# EAGLE schematic IRQF401RCT6 (EAGLE 7.6.0)
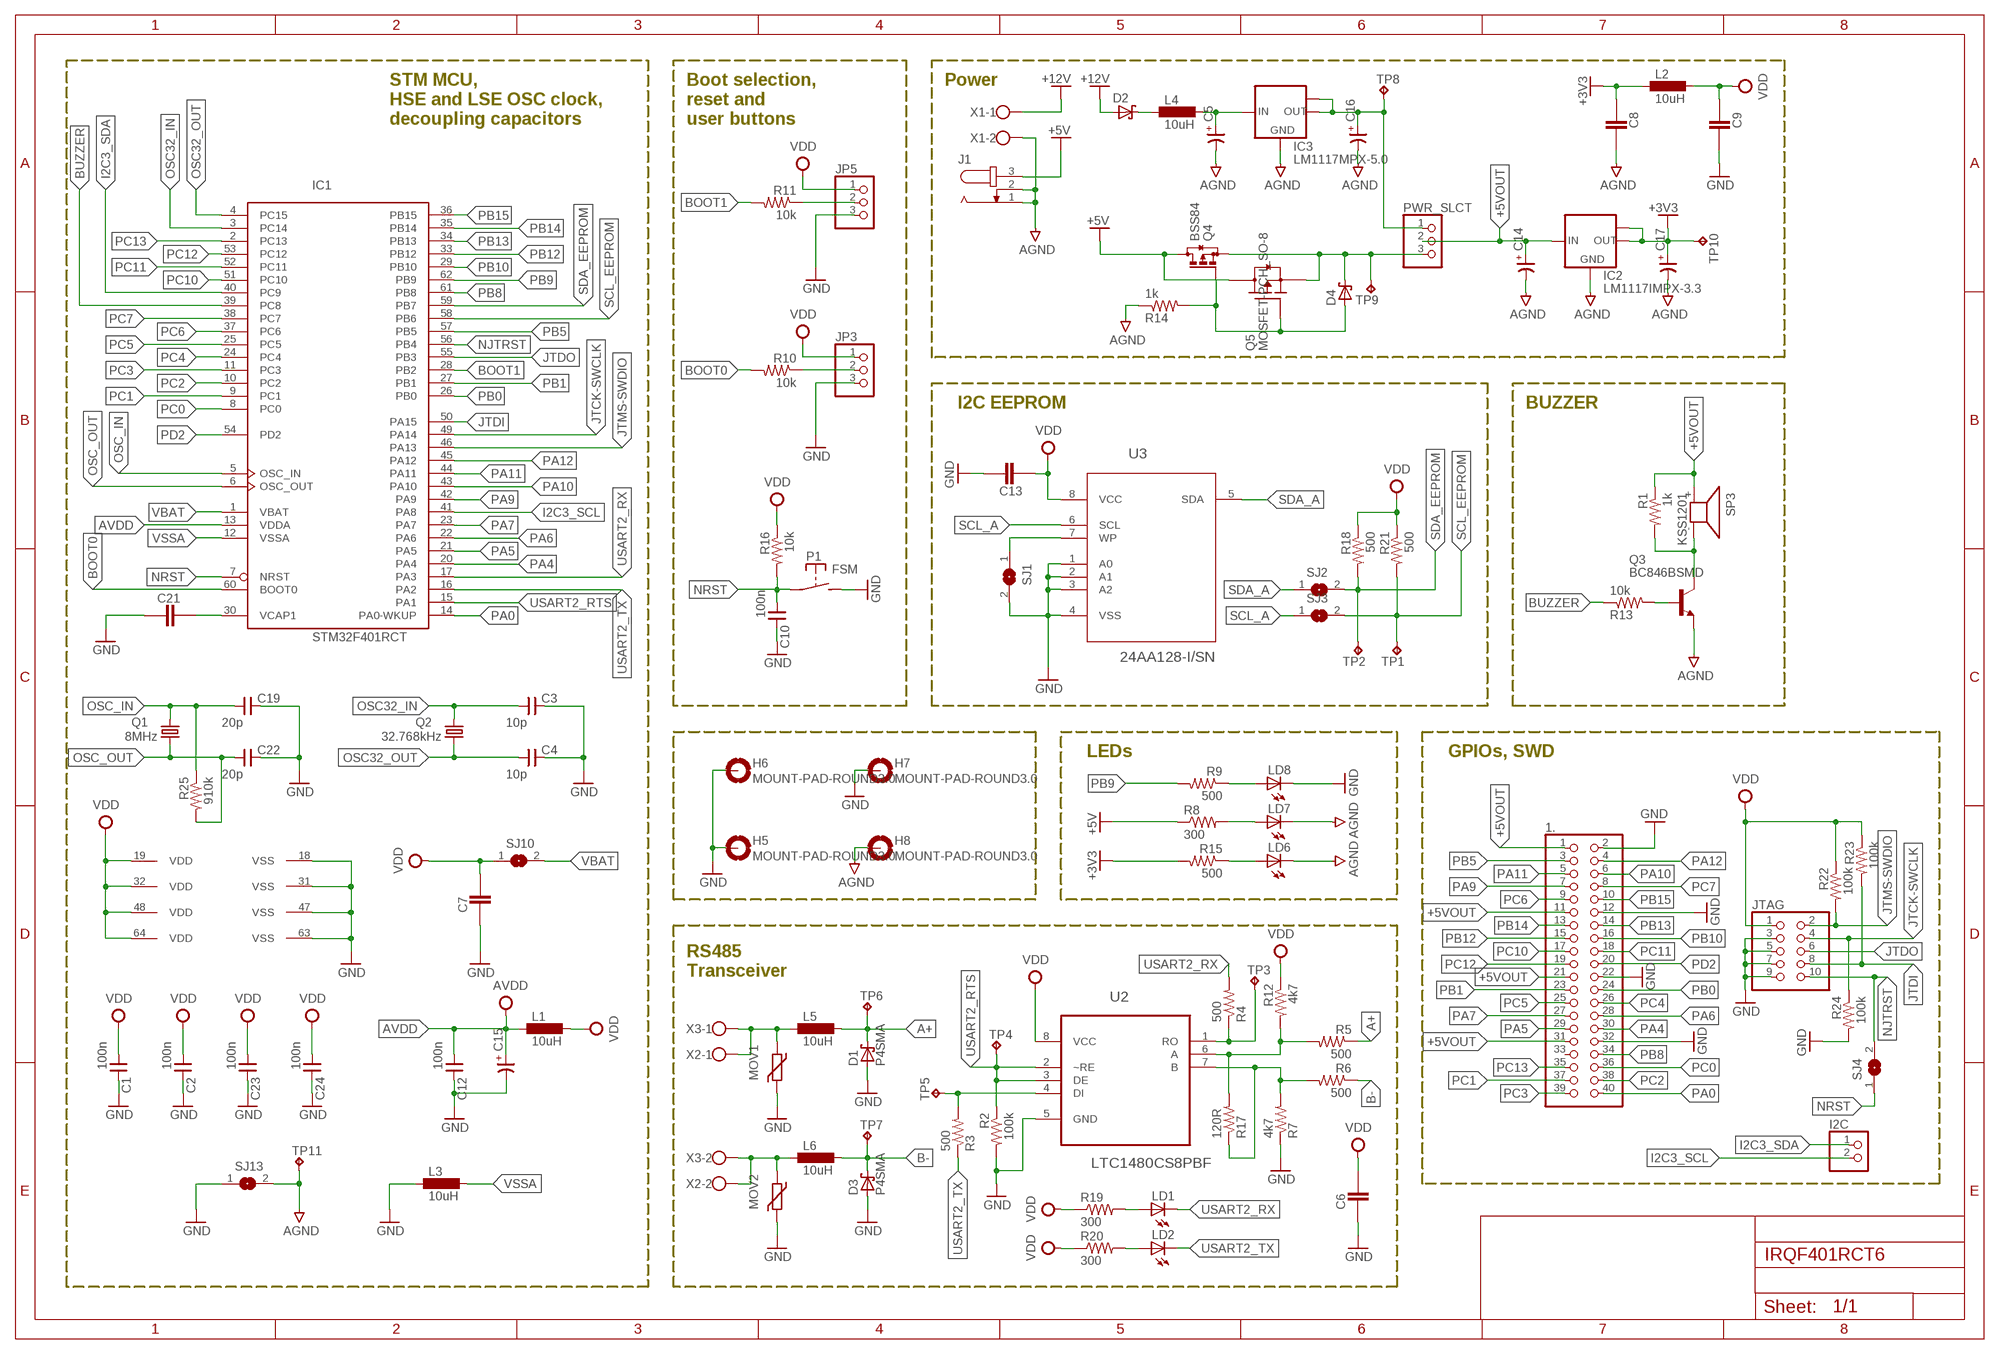
[diagram p0: schematic, sheet 1]

## Parts
1.  PINHD-2X20  [2X20]
C1  100n  CNP-0805  [0805]
C2  100n  CNP-0805  [0805]
C3  10p  CNP-0805  [0805]
C4  10p  CNP-0805  [0805]
C5  CP-3258-TE-B  [3528-TE-B]
C6  CAPACITOR_1206  [CAPC3215X168N]
C7  CAPACITOR_1206  [CAPC3215X168N]
C8  CAPACITOR_1206  [CAPC3215X168N]
C9  CAPACITOR_1206  [CAPC3215X168N]
C10  100n  CNP-0805  [0805]
C12  100n  CNP-0805  [0805]
C13  CAPACITOR_1206  [CAPC3215X168N]
C14  CP-3258-TE-B  [3528-TE-B]
C15  CP-3216  [3216/T]
C16  CP-3216-TE-A  [3216-TE-A]
C17  CP-3216-TE-A  [3216-TE-A]
C19  20p  CNP-0805  [0805]
C21  CAPACITOR_1206  [CAPC3215X168N]
C22  20p  CNP-0805  [0805]
C23  100n  CNP-0805  [0805]
C24  100n  CNP-0805  [0805]
D1  P4SMA  SCHOTTKY-DIODESMD  [SMB]
D2  SCHOTTKY_SMA  [DIOM5326X292N]
D3  P4SMA  SCHOTTKY-DIODESMD  [SMB]
D4  SCHOTTKY_SMA  [DIOM5326X292N]
H5  MOUNT-PAD-ROUND3.0  [3,0-PAD]
H6  MOUNT-PAD-ROUND3.0  [3,0-PAD]
H7  MOUNT-PAD-ROUND3.0  [3,0-PAD]
H8  MOUNT-PAD-ROUND3.0  [3,0-PAD]
I2C  PINHD-1X2  [1X02]
IC1  STM32F401RCT  [LQFP64]
IC2  LM1117IMPX-3.3  [SOT223]
IC3  LM1117MPX-5.0  [SOT223]
J1  JACK-PLUG1  [SPC4078]
JP3  PINHD-1X3  [1X03]
JP5  PINHD-1X3  [1X03]
JTAG  PINHD-2X5  [2X05]
L1  10uH  INDUCTOR_0603  [INDC1608X95N]
L2  10uH  INDUCTOR_0603  [INDC1608X95N]
L3  10uH  INDUCTOR_0603  [INDC1608X95N]
L4  10uH  INDUCTOR_0603  [INDC1608X95N]
L5  10uH  INDUCTOR_0603  [INDC1608X95N]
L6  10uH  INDUCTOR_0603  [INDC1608X95N]
LD1  LEDCHIPLED_0805  [CHIPLED_0805]
LD2  LEDCHIPLED_0805  [CHIPLED_0805]
LD6  LEDCHIPLED_0805  [CHIPLED_0805]
LD7  LEDCHIPLED_0805  [CHIPLED_0805]
LD8  LEDCHIPLED_0805  [CHIPLED_0805]
MOV1  VARISTOR_0805  [VARC2012X70N]
MOV2  VARISTOR_0805  [VARC2012X70N]
P1  FSM  [FSM]
PWR_SLCT  PINHD-1X3  [1X03]
Q1  8MHz  CRYTALHC49S  [HC49/S]
Q2  32.768kHz  CRYTALTC26H  [TC26H]
Q3  BC846BSMD  [SOT23]
Q4  BSS84  [SOT23]
Q5  MOSFET-PCH_SO-8  [SOIC127P600X175-8AN]
R1  1k  R-US_M0805  [M0805]
R2  100k  R-US_M0805  [M0805]
R3  500  R-US_M0805  [M0805]
R4  500  R-US_M0805  [M0805]
R5  500  R-US_M0805  [M0805]
R6  500  R-US_M0805  [M0805]
R7  4k7  R-US_M0805  [M0805]
R8  300  R-US_M0805  [M0805]
R9  500  R-US_M0805  [M0805]
R10  10k  R-US_M0805  [M0805]
R11  10k  R-US_M0805  [M0805]
R12  4k7  R-US_M0805  [M0805]
R13  10k  R-US_M0805  [M0805]
R14  1k  R-US_M0805  [M0805]
R15  500  R-US_M0805  [M0805]
R16  10k  R-US_M0805  [M0805]
R17  120R  R-US_M0805  [M0805]
R18  500  R-US_M0805  [M0805]
R19  300  R-US_M0805  [M0805]
R20  300  R-US_M0805  [M0805]
R21  500  R-US_M0805  [M0805]
R22  100k  R-US_M0805  [M0805]
R23  100k  R-US_M0805  [M0805]
R24  100k  R-US_M0805  [M0805]
R25  910k  R-US_M0805  [M0805]
SJ1  SJ  [SJ]
SJ2  SJ  [SJ]
SJ3  SJ  [SJ]
SJ4  SJ  [SJ]
SJ10  SJ  [SJ]
SJ13  SJ  [SJ]
SP3  KSS1201  [KSS1201]
TP1  TPTP10R  [TP10R]
TP2  TPTP10R  [TP10R]
TP3  TPTP10R  [TP10R]
TP4  TPTP10R  [TP10R]
TP5  TPTP10R  [TP10R]
TP6  TPTP10R  [TP10R]
TP7  TPTP10R  [TP10R]
TP8  TPTP10R  [TP10R]
TP9  TPTP10R  [TP10R]
TP10  TPTP10R  [TP10R]
TP11  TPTP10R  [TP10R]
U2  LTC1480CS8PBF  [SOIC127P600X175-8N]
U3  24AA128-I/SN  [SOIC127P600X175-8N]
X1  W237-102  [W237-102]
X2  W237-102  [W237-102]
X3  W237-102  [W237-102]

## Nets
+3V3: C8.1 C17.+ IC2.2(OUT) IC2.TAB(OUT1) L2.1 R15.2 TP10.TP
+5V: J1.3 Q4.3(D) Q5.5(D) R8.1
+5VOUT: 1..1 1..11 1..21 1..31 C14.+ IC2.3(IN) PWR_SLCT.2 R1.1 SP3.+
+12V: D2.A X1.1
A+: D1.C L5.2 R5.1 TP6.TP
AGND: C5.- C8.2 C14.- C16.- C17.- H8.B3,0(MOUNT) IC2.1(GND) IC3.1(GND) J1.1 J1.2 LD6.C LD7.C Q3.2(E) R14.1 SJ13.2 TP11.TP X1.2
AVDD: C12.1 C15.+ IC1.13(VDDA) L1.1
B-: D3.C L6.2 R6.1 TP7.TP
BOOT0: IC1.60(BOOT0) R10.2
BOOT1: IC1.28(PB2) R11.2
BUZZER: IC1.39(PC8) R13.1
GND: 1..2 1..12 1..22 1..32 C1.2 C2.2 C3.2 C4.2 C6.1 C7.1 C9.2 C10.2 C12.2 C13.2 C15.- C19.2 C21.1 C22.2 C23.2 C24.2 D1.A D3.A H5.B3,0(MOUNT) H6.B3,0(MOUNT) H7.B3,0(MOUNT) IC1.18(VSS) IC1.31(VSS) IC1.47(VSS) IC1.63(VSS) JP3.3 JP5.3 JTAG.3 JTAG.5 JTAG.7 JTAG.9 L3.1 LD8.C MOV1.1 MOV2.1 P1.P$2(S) R2.2 R7.1 R24.2 SJ1.2 SJ13.1 U2.5(GND) U3.1(A0) U3.2(A1) U3.3(A2) U3.4(VSS)
I2C3_SCL: I2C.2 IC1.41(PA8)
I2C3_SDA: I2C.1 IC1.40(PC9)
JTCK-SWCLK: IC1.49(PA14) JTAG.4 R24.1
JTDI: IC1.50(PA15) JTAG.8 R23.2
JTDO: IC1.55(PB3) JTAG.6
JTMS-SWDIO: IC1.46(PA13) JTAG.2 R22.2
N$1: SJ1.1 U3.7(WP)
N$2: C21.2 IC1.30(VCAP1)
N$3: D2.K L4.1
N$4: R6.2 R7.2 R17.1 U2.7(B)
N$5: JP3.2 R10.1
N$6: LD7.A R8.2
N$8: R3.2 TP5.TP U2.4(DI)
N$9: R5.2 R12.2 R17.2 U2.6(A)
N$10: C5.+ IC3.3(IN) L4.2
N$12: L5.1 MOV1.2 X2.1 X3.1
N$13: L6.1 MOV2.2 X2.2 X3.2
N$14: R4.1 TP3.TP U2.1(RO)
N$15: LD8.A R9.1
N$17: Q3.3(C) R1.2 SP3.-
N$18: Q3.1(B) R13.2
N$19: LD6.A R15.1
N$20: LD1.A R19.2
N$21: LD2.A R20.2
N$22: D4.A Q4.1(G) Q5.4(G) R14.2
N$25: D4.K PWR_SLCT.3 Q4.2(S) Q5.1(S) TP9.TP
NJTRST: IC1.56(PB4) JTAG.10 SJ4.2
NRST: C10.1 IC1.7(NRST) P1.P$1(P) R16.2 SJ4.1
OSC32_IN: C3.1 IC1.3(PC14) Q2.2
OSC32_OUT: C4.1 IC1.4(PC15) Q2.1
OSC_IN: C19.1 IC1.5(OSC_IN) Q1.2 R25.1
OSC_OUT: C22.1 IC1.6(OSC_OUT) Q1.1 R25.2
PA0: 1..40 IC1.14(PA0-WKUP)
PA4: 1..30 IC1.20(PA4)
PA5: 1..29 IC1.21(PA5)
PA6: 1..28 IC1.22(PA6)
PA7: 1..27 IC1.23(PA7)
PA9: 1..7 IC1.42(PA9)
PA10: 1..6 IC1.43(PA10)
PA11: 1..5 IC1.44(PA11)
PA12: 1..4 IC1.45(PA12)
PB0: 1..24 IC1.26(PB0)
PB1: 1..23 IC1.27(PB1)
PB2: JP5.2 R11.1
PB5: 1..3 IC1.57(PB5)
PB8: 1..34 IC1.61(PB8)
PB9: IC1.62(PB9) R9.2
PB10: 1..16 IC1.29(PB10)
PB12: 1..15 IC1.33(PB12)
PB13: 1..14 IC1.34(PB13)
PB14: 1..13 IC1.35(PB14)
PB15: 1..10 IC1.36(PB15)
PC0: 1..36 IC1.8(PC0)
PC1: 1..37 IC1.9(PC1)
PC2: 1..38 IC1.10(PC2)
PC3: 1..39 IC1.11(PC3)
PC4: 1..26 IC1.24(PC4)
PC5: 1..25 IC1.25(PC5)
PC6: 1..9 IC1.37(PC6)
PC7: 1..8 IC1.38(PC7)
PC10: 1..17 IC1.51(PC10)
PC11: 1..18 IC1.52(PC11)
PC12: 1..19 IC1.53(PC12)
PC13: 1..35 IC1.2(PC13)
PD2: 1..20 IC1.54(PD2)
SCL_A: SJ3.1 U3.6(SCL)
SCL_EEPROM: IC1.58(PB6) R21.2 SJ3.2 TP1.TP
SDA_A: SJ2.1 U3.5(SDA)
SDA_EEPROM: IC1.59(PB7) R18.2 SJ2.2 TP2.TP
USART2_RTS: IC1.15(PA1) R2.1 TP4.TP U2.2(~RE) U2.3(DE)
USART2_RX: IC1.17(PA3) LD1.C R4.2
USART2_TX: IC1.16(PA2) LD2.C R3.1
VBAT: IC1.1(VBAT) SJ10.2
VCC_OUT: C16.+ IC3.2(OUT) IC3.TAB(OUT1) PWR_SLCT.1 TP8.TP
VDD: C1.1 C2.1 C6.2 C7.2 C9.1 C13.1 C23.1 C24.1 IC1.19(VDD) IC1.32(VDD) IC1.48(VDD) IC1.64(VDD) JP3.1 JP5.1 JTAG.1 L1.2 L2.2 R12.1 R16.1 R18.1 R19.1 R20.1 R21.1 R22.1 R23.1 SJ10.1 U2.8(VCC) U3.8(VCC)
VSSA: IC1.12(VSSA) L3.2
Unconnected: 1..33

## Notes on the sheet
- Power
- STM MCU, 
  HSE and LSE OSC clock,
  decoupling capacitors
- Boot selection,
  reset and
  user buttons
- I2C EEPROM | BUZZER
- LEDs | GPIOs, SWD
- RS485
  Transceiver

## Library data of the parts
1. = pinhead:PINHD-2X20: PIN HEADER
C1-C4 C10 C12 C19 C22-C24 = cap-master:CNP-: NON-POLARIZED CAP
C5 C14-C17 = cap-master:CP-: POLARIZED CAP
C6-C9 C13 C21 = ipc-7351-capacitor:CAPACITOR_
D1 D3 = diode:SCHOTTKY-DIODE: Schottky Diode
D2 D4 = ipc-7351-diode:SCHOTTKY_
H5-H8 = holes:MOUNT-PAD-ROUND: MOUNTING PAD, round
I2C = pinhead:PINHD-1X2: PIN HEADER
IC1 = micro-stm:STM32F401R*T: ARM 32-bit Cortex™-M3 CPU 84 MHz maximum frequency 128 to 256 Kbytes of Flash memory 64 kbytes of SRAM 50 GPIOs 1.7 to 3.6 V application supply
IC2 = lm1117:LM1117IMPX-*
IC3 = lm1117:LM1117MPX-*
J1 = con-jack:JACK-PLUG: DC POWER JACK Power Jack, DC, Right Angle, Through Hole, Rated 5A at 16VDC, PC Terminals Distributor: Farnell (www.Farnell.de) Drawing: 84N1161.pdf / 84N1162.pdf Manufacturer: SPC Technology (www.spctechnology.com) Type: SPC4077 / SPC 4078
JP3 JP5 PWR_SLCT = pinhead:PINHD-1X3: PIN HEADER
JTAG = pinhead:PINHD-2X5: PIN HEADER
L1-L6 = ipc-7351-inductor:INDUCTOR_
LD1 LD2 LD6-LD8 = led:LED: LED OSRAM: - CHIPLED LG R971, LG N971, LY N971, LG Q971, LY Q971, LO R971, LY R971 LH N974, LH R974 LS Q976, LO Q976, LY Q976 LO Q996 - Hyper CHIPLED LW Q18S LB Q993, LB Q99A, LB R99A - SideLED LS A670, LO A670, LY A670, LG A670, LP A670 LB A673, LV A673, LT A673, LW A673 LH A674 LY A675 LS A676, LA A676, LO A676, LY A676, LW A676 LS A679, LY A679, LG A679 - Hyper Micro SIDELED® LS Y876, LA Y876, LO Y876, LY Y876 LT Y87S - SmartLED LW L88C, LW L88S LB L89C, LB L89S, LG L890 LS L89K, LO L89K, LY L89K LS L896, LA L896, LO L896, LY L896 - TOPLED LS T670, LO T670, LY T670, LG T670, LP T670 LSG T670, LSP T670, LSY T670, LOP T670, LYG T670 LG T671, LOG T671, LSG T671 LB T673, LV T673, LT T673, LW T673 LH T674 LS T676, LA T676, LO T676, LY T676, LB T676, LH T676, LSB T676, LW T676 LB T67C, LV T67C, LT T67C, LS T67K, LO T67K, LY T67K, LW E67C LS E67B, LA E67B, LO E67B, LY E67B, LB E67C, LV E67C, LT E67C LW T67C LS T679, LY T679, LG T679 LS T770, LO T770, LY T770, LG T770, LP T770 LB T773, LV T773, LT T773, LW T773 LH T774 LS E675, LA E675, LY E675, LS T675 LS T776, LA T776, LO T776, LY T776, LB T776 LHGB T686 LT T68C, LB T68C - Hyper Mini TOPLED® LB M676 - Mini TOPLED Santana® LG M470 LS M47K, LO M47K, LY M47K Source: http://www.osram.convergy.de/
MOV1 MOV2 = varistor:VARISTOR_: MLA Varistor Series. The MLA Series (also known as "ML" series) family of transient voltage surge suppression devices is based on the Littelfuse Multilayer fabrication technology.
P1 = switch-misc:FSM: TYCO SWITCH
Q1 Q2 = crystal:CRYTAL: CRYSTAL
Q3 = transistor-npn:BC846*: NPN Transistor
Q4 = transistor-small-signal:BSS84: P-CHANNEL MOS FET
Q5 = ipc-7351-transistor:MOSFET-PCH_
R1-R25 = resistor:R-US_: RESISTOR, American symbol
SJ1-SJ4 SJ10 SJ13 = jumper:SJ: SMD solder JUMPER
SP3 = buzzer:KSS1201: SPEAKER Source: Schukat
TP1-TP11 = testpad:TP: Test pad
U2 = LTC_By_element14_Batch_1:LTC1480CS8PBF: 3.3V Ultralow Power RS485 Transceiver; MPN: LTC1480CS8#PBF; OC_FARNELL: 1663633; OC_NEWARK: 56M1547; PACKAGE: SOIC-8; SUPPLIER: Linear Technology
U3 = Microchip_By_element14_Batch_1:24AA128-I/SN: 128K I2C CMOS Serial EEPROM; DESCRIPTION: 128K I2C CMOS Serial EEPROM; MPN: 24AA128-I/SN; OC_FARNELL: -; OC_NEWARK: 92C6842; PACKAGE: SOIC-8; SUPPLIER: Microchip
X1-X3 = con-wago-500:W237-102: WAGO SCREW CLAMP